# EAGLE schematic ExtensionBoard (EAGLE 6.1)
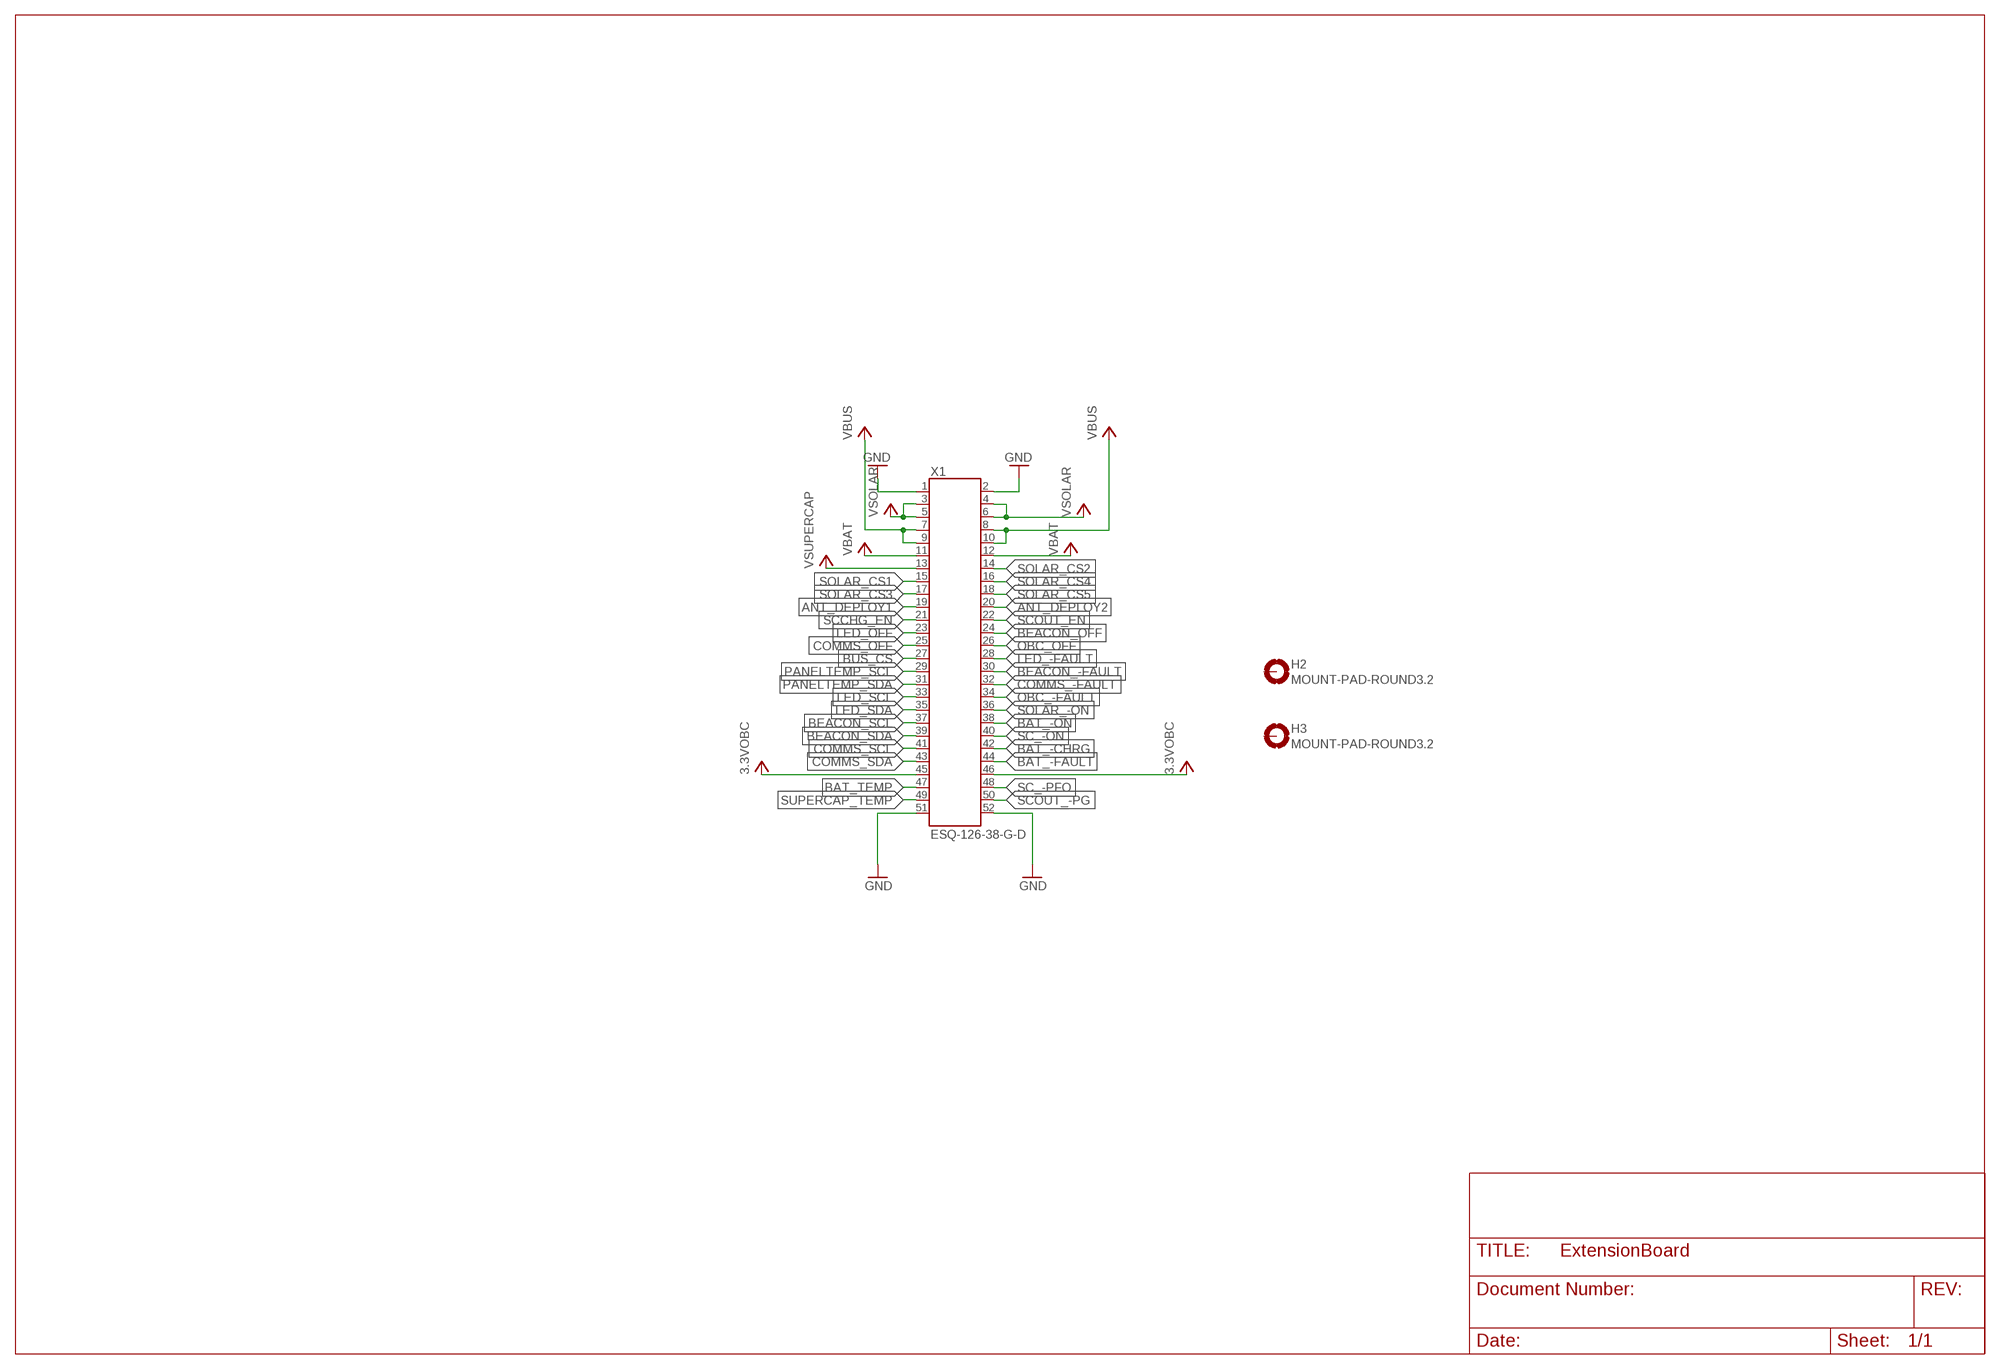
[diagram p0: schematic, sheet 1]

## Parts
H2  MOUNT-PAD-ROUND3.2  [3.2-PAD-ROUND]
H3  MOUNT-PAD-ROUND3.2  [3.2-PAD-ROUND]
X1  ESQ-126-38-G-D  [ESQ-126-XX-X-D]

## Nets
3.3VOBC: X1.45 X1.46
ANT_DEPLOY1: X1.19
ANT_DEPLOY2: X1.20
BAT_-CHRG: X1.42
BAT_-FAULT: X1.44
BAT_-ON: X1.38
BAT_TEMP: X1.47
BEACON_-FAULT: X1.30
BEACON_OFF: X1.24
BEACON_SCL: X1.37
BEACON_SDA: X1.39
BUS_CS: X1.27
COMMS_-FAULT: X1.32
COMMS_OFF: X1.25
COMMS_SCL: X1.41
COMMS_SDA: X1.43
GND: X1.1 X1.2 X1.51 X1.52
LED_-FAULT: X1.28
LED_OFF: X1.23
LED_SCL: X1.33
LED_SDA: X1.35
OBC_-FAULT: X1.34
OBC_OFF: X1.26
PANELTEMP_SCL: X1.29
PANELTEMP_SDA: X1.31
SC_-ON: X1.40
SC_-PFO: X1.48
SCCHG_EN: X1.21
SCOUT_-PG: X1.50
SCOUT_EN: X1.22
SOLAR_-ON: X1.36
SOLAR_CS1: X1.15
SOLAR_CS2: X1.14
SOLAR_CS3: X1.17
SOLAR_CS4: X1.16
SOLAR_CS5: X1.18
SUPERCAP_TEMP: X1.49
VBAT: X1.11 X1.12
VBUS: X1.7 X1.8 X1.9 X1.10
VSOLAR: X1.3 X1.4 X1.5 X1.6
VSUPERCAP: X1.13
Unconnected: H2.B3,2(MOUNT) H3.B3,2(MOUNT)

## Library data of the parts
H2 H3 = OSSI:MOUNT-PAD-ROUND
X1 = OSSI:ESQ-126-: Samtec ESQ-126-XX-G-D Elevated Sockets Seires ESQ-126-37-G-D ESQ-126-38-G-D ESQ-126-39-G-D